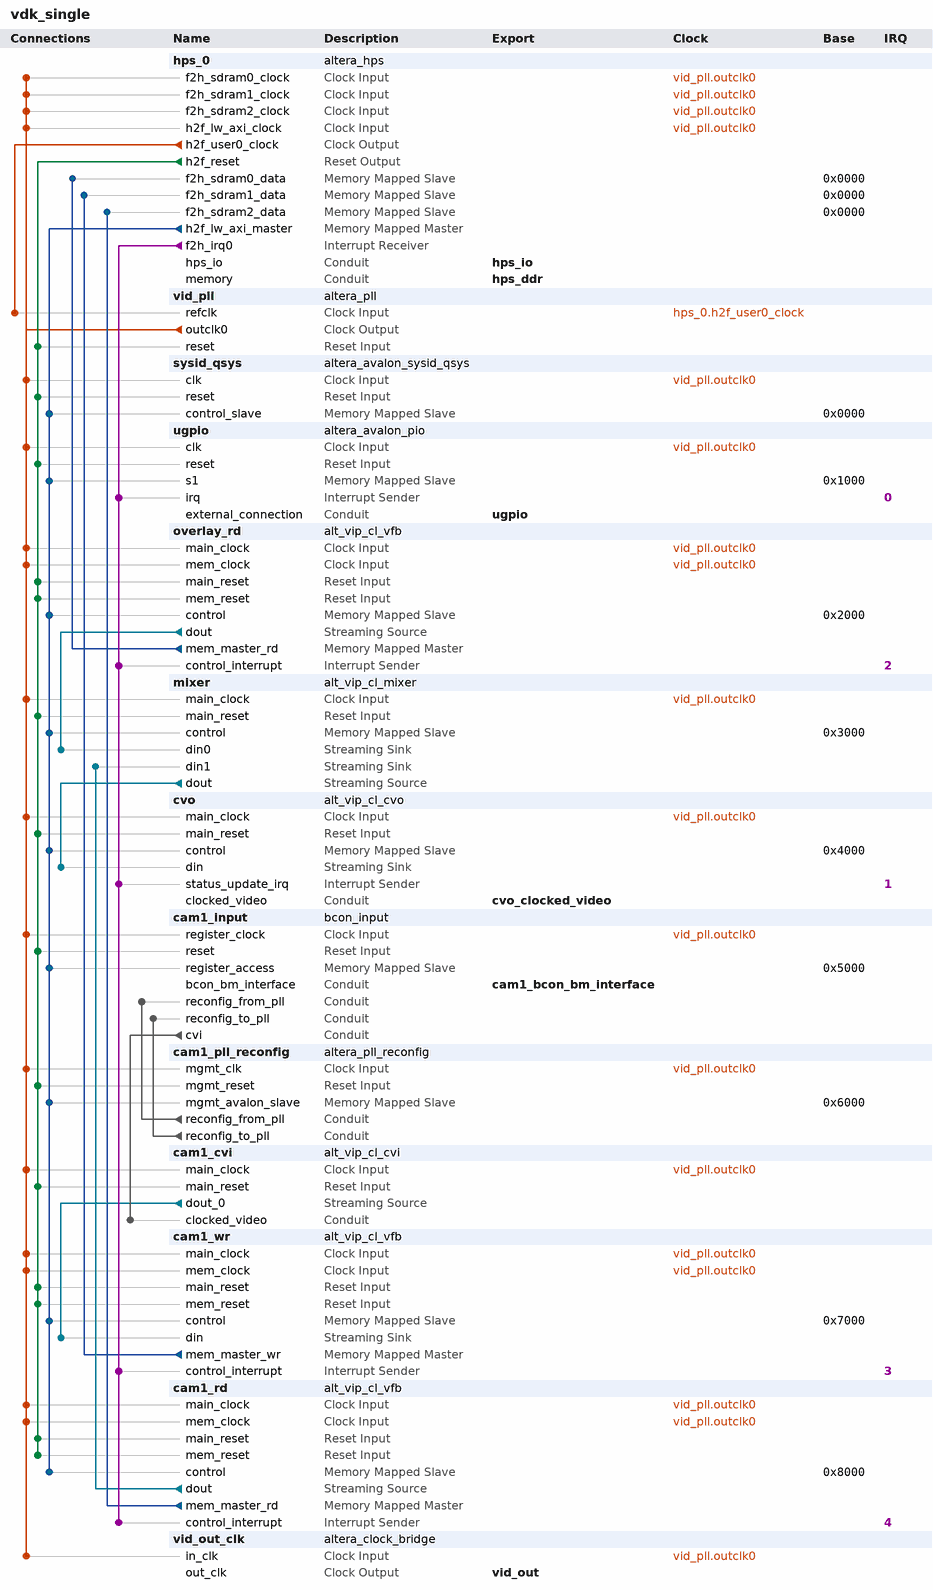
[diagram p0: system contents]
# Platform Designer (Qsys) system vdk_single, Cyclone V 5CSXFC6C6U23C7
# Parameters at their usual value, and those the tool derives, are not listed.
package require -exact qsys 17.0
create_system vdk_single
set_project_property DEVICE_FAMILY {Cyclone V}
set_project_property DEVICE 5CSXFC6C6U23C7

add_instance hps_0 altera_hps 17.0
set_instance_parameter_value hps_0 EMAC1_Mode RGMII
set_instance_parameter_value hps_0 EMAC1_PinMuxing {HPS I/O Set 0}
set_instance_parameter_value hps_0 F2SCLK_COLDRST_Enable false
set_instance_parameter_value hps_0 F2SCLK_DBGRST_Enable false
set_instance_parameter_value hps_0 F2SCLK_WARMRST_Enable false
set_instance_parameter_value hps_0 F2SDRAM_Type {Avalon-MM Read-Only,Avalon-MM Write-Only,Avalon-MM Read-Only}
set_instance_parameter_value hps_0 F2SDRAM_Width 64,64,64
set_instance_parameter_value hps_0 F2SINTERRUPT_Enable true
set_instance_parameter_value hps_0 F2S_Width 0
set_instance_parameter_value hps_0 FPGA_PERIPHERAL_OUTPUT_CLOCK_FREQ_EMAC0_GTX_CLK 100
set_instance_parameter_value hps_0 FPGA_PERIPHERAL_OUTPUT_CLOCK_FREQ_EMAC0_MD_CLK 100.0
set_instance_parameter_value hps_0 FPGA_PERIPHERAL_OUTPUT_CLOCK_FREQ_EMAC1_GTX_CLK 100
set_instance_parameter_value hps_0 FPGA_PERIPHERAL_OUTPUT_CLOCK_FREQ_EMAC1_MD_CLK 100.0
set_instance_parameter_value hps_0 HPS_PROTOCOL DDR3
set_instance_parameter_value hps_0 I2C0_Mode I2C
set_instance_parameter_value hps_0 I2C0_PinMuxing {HPS I/O Set 1}
set_instance_parameter_value hps_0 I2C1_Mode I2C
set_instance_parameter_value hps_0 I2C1_PinMuxing {HPS I/O Set 0}
set_instance_parameter_value hps_0 LWH2F_Enable true
set_instance_parameter_value hps_0 MEM_ASR Automatic
set_instance_parameter_value hps_0 MEM_BANKADDR_WIDTH 3
set_instance_parameter_value hps_0 MEM_CLK_FREQ 400.0
set_instance_parameter_value hps_0 MEM_COL_ADDR_WIDTH 10
set_instance_parameter_value hps_0 MEM_DQ_WIDTH 40
set_instance_parameter_value hps_0 MEM_DRV_STR RZQ/7
set_instance_parameter_value hps_0 MEM_ROW_ADDR_WIDTH 15
set_instance_parameter_value hps_0 MEM_RTT_NOM RZQ/4
set_instance_parameter_value hps_0 MEM_RTT_WR {Dynamic ODT off}
set_instance_parameter_value hps_0 MEM_TCL 7
set_instance_parameter_value hps_0 MEM_TFAW_NS 30.0
set_instance_parameter_value hps_0 MEM_TRAS_NS 35.0
set_instance_parameter_value hps_0 MEM_TRCD_NS 13.75
set_instance_parameter_value hps_0 MEM_TRFC_NS 260.0
set_instance_parameter_value hps_0 MEM_TRP_NS 13.75
set_instance_parameter_value hps_0 MEM_TRRD_NS 10.0
set_instance_parameter_value hps_0 MEM_TRTP_NS 10.0
set_instance_parameter_value hps_0 MEM_VENDOR JEDEC
set_instance_parameter_value hps_0 MEM_VOLTAGE {1.35V DDR3L}
set_instance_parameter_value hps_0 MEM_WTCL 6
set_instance_parameter_value hps_0 QSPI_Mode {2 SS}
set_instance_parameter_value hps_0 QSPI_PinMuxing {HPS I/O Set 1}
set_instance_parameter_value hps_0 REF_CLK_FREQ 25.0
set_instance_parameter_value hps_0 S2FCLK_USER0CLK_Enable true
set_instance_parameter_value hps_0 S2FCLK_USER2CLK 5
set_instance_parameter_value hps_0 S2F_Width 0
set_instance_parameter_value hps_0 SDIO_Mode {4-bit Data}
set_instance_parameter_value hps_0 SDIO_PinMuxing {HPS I/O Set 0}
set_instance_parameter_value hps_0 SPIM1_Mode N/A
set_instance_parameter_value hps_0 SPIM1_PinMuxing Unused
set_instance_parameter_value hps_0 STM_Enable false
set_instance_parameter_value hps_0 TIMING_BOARD_AC_SKEW 0.0
set_instance_parameter_value hps_0 TIMING_BOARD_AC_TO_CK_SKEW 0.0
set_instance_parameter_value hps_0 TIMING_BOARD_DQ_TO_DQS_SKEW 0.0
set_instance_parameter_value hps_0 TIMING_BOARD_MAX_CK_DELAY 0.6
set_instance_parameter_value hps_0 TIMING_BOARD_MAX_DQS_DELAY 0.2
set_instance_parameter_value hps_0 TIMING_BOARD_SKEW_BETWEEN_DQS 0.01
set_instance_parameter_value hps_0 TIMING_BOARD_SKEW_CKDQS_DIMM_MAX 0.215
set_instance_parameter_value hps_0 TIMING_BOARD_SKEW_CKDQS_DIMM_MIN 0.092
set_instance_parameter_value hps_0 TIMING_BOARD_SKEW_WITHIN_DQS 0.0
set_instance_parameter_value hps_0 TIMING_TDH 45
set_instance_parameter_value hps_0 TIMING_TDQSCK 225
set_instance_parameter_value hps_0 TIMING_TDQSQ 100
set_instance_parameter_value hps_0 TIMING_TDQSS 0.27
set_instance_parameter_value hps_0 TIMING_TDS 10
set_instance_parameter_value hps_0 TIMING_TDSH 0.18
set_instance_parameter_value hps_0 TIMING_TDSS 0.18
set_instance_parameter_value hps_0 TIMING_TIH 120
set_instance_parameter_value hps_0 TIMING_TIS 170
set_instance_parameter_value hps_0 TIMING_TQSH 0.4
set_instance_parameter_value hps_0 UART0_Mode {No Flow Control}
set_instance_parameter_value hps_0 UART0_PinMuxing {HPS I/O Set 2}
set_instance_parameter_value hps_0 USB1_Mode SDR
set_instance_parameter_value hps_0 USB1_PinMuxing {HPS I/O Set 0}
set_instance_parameter_value hps_0 desired_cfg_clk_mhz 100.0
set_instance_parameter_value hps_0 desired_qspi_clk_mhz 400.0

add_instance vid_pll altera_pll 17.0
set_instance_parameter_value vid_pll gui_device_speed_grade 2
set_instance_parameter_value vid_pll gui_number_of_clocks 1
set_instance_parameter_value vid_pll gui_operation_mode direct
set_instance_parameter_value vid_pll gui_output_clock_frequency0 74.25
set_instance_parameter_value vid_pll gui_pll_mode {Integer-N PLL}
set_instance_parameter_value vid_pll gui_reference_clock_frequency 100.0
set_instance_parameter_value vid_pll gui_use_locked false

add_instance sysid_qsys altera_avalon_sysid_qsys 17.0
set_instance_parameter_value sysid_qsys id 1

add_instance ugpio altera_avalon_pio 17.0
set_instance_parameter_value ugpio bitClearingEdgeCapReg true
set_instance_parameter_value ugpio bitModifyingOutReg true
set_instance_parameter_value ugpio captureEdge true
set_instance_parameter_value ugpio direction Bidir
set_instance_parameter_value ugpio generateIRQ true
set_instance_parameter_value ugpio irqType EDGE
set_instance_parameter_value ugpio width 7

add_instance overlay_rd alt_vip_cl_vfb 17.0
set_instance_parameter_value overlay_rd CLOCKS_ARE_SEPARATE 1
set_instance_parameter_value overlay_rd DROP_FRAMES 1
set_instance_parameter_value overlay_rd DROP_INVALID_FIELDS 1
set_instance_parameter_value overlay_rd DROP_REPEAT_USER 0
set_instance_parameter_value overlay_rd IS_FRAME_READER 1
set_instance_parameter_value overlay_rd MAX_HEIGHT 720
set_instance_parameter_value overlay_rd MAX_WIDTH 1280
set_instance_parameter_value overlay_rd MEM_BASE_ADDR 536870912
set_instance_parameter_value overlay_rd MEM_BUFFER_OFFSET 16777216
set_instance_parameter_value overlay_rd MEM_PORT_WIDTH 64
set_instance_parameter_value overlay_rd READER_RUNTIME_CONTROL 1
set_instance_parameter_value overlay_rd READ_FIFO_DEPTH 64
set_instance_parameter_value overlay_rd USER_PACKETS_MAX_STORAGE 0
set_instance_parameter_value overlay_rd USE_BUFFER_OFFSET 0
set_instance_parameter_value overlay_rd WRITE_BURST_TARGET 32
set_instance_parameter_value overlay_rd WRITE_FIFO_DEPTH 64

add_instance mixer alt_vip_cl_mixer 17.0
set_instance_parameter_value mixer ALPHA_ENABLE 1
set_instance_parameter_value mixer ALPHA_STREAMS_ENABLE 0
set_instance_parameter_value mixer BITS_PER_SYMBOL 8
set_instance_parameter_value mixer COLOR_PLANES_ARE_IN_PARALLEL 1
set_instance_parameter_value mixer COLOR_SPACE RGB
set_instance_parameter_value mixer FAMILY {Cyclone V}
set_instance_parameter_value mixer IS_422 1
set_instance_parameter_value mixer LAYER_POSITION_ENABLE 1
set_instance_parameter_value mixer MAX_HEIGHT 720
set_instance_parameter_value mixer MAX_WIDTH 1280
set_instance_parameter_value mixer NO_OF_INPUTS 2
set_instance_parameter_value mixer NUMBER_OF_COLOR_PLANES 2
set_instance_parameter_value mixer PATTERN uniform
set_instance_parameter_value mixer PIPELINE_READY 0
set_instance_parameter_value mixer PIXELS_IN_PARALLEL 1
set_instance_parameter_value mixer UNIFORM_VALUE_BCR 0
set_instance_parameter_value mixer UNIFORM_VALUE_GCB 0
set_instance_parameter_value mixer UNIFORM_VALUE_RY 255
set_instance_parameter_value mixer USER_PACKET_FIFO_DEPTH 0
set_instance_parameter_value mixer USER_PACKET_SUPPORT DISCARD

add_instance cvo alt_vip_cl_cvo 17.0
set_instance_parameter_value cvo ACCEPT_COLOURS_IN_SEQ 0
set_instance_parameter_value cvo ANC_LINE 0
set_instance_parameter_value cvo AP_LINE 0
set_instance_parameter_value cvo BPS 8
set_instance_parameter_value cvo CLOCKS_ARE_SAME 1
set_instance_parameter_value cvo COLOUR_PLANES_ARE_IN_PARALLEL 1
set_instance_parameter_value cvo CONTEXT_WIDTH 8
set_instance_parameter_value cvo DST_WIDTH 8
set_instance_parameter_value cvo FIELD0_ANC_LINE 0
set_instance_parameter_value cvo FIELD0_V_BACK_PORCH 0
set_instance_parameter_value cvo FIELD0_V_BLANK 0
set_instance_parameter_value cvo FIELD0_V_FRONT_PORCH 0
set_instance_parameter_value cvo FIELD0_V_RISING_EDGE 0
set_instance_parameter_value cvo FIELD0_V_SYNC_LENGTH 0
set_instance_parameter_value cvo FIFO_DEPTH 1280
set_instance_parameter_value cvo F_FALLING_EDGE 0
set_instance_parameter_value cvo F_RISING_EDGE 0
set_instance_parameter_value cvo GENERATE_SYNC 0
set_instance_parameter_value cvo H_ACTIVE_PIXELS 1280
set_instance_parameter_value cvo H_BACK_PORCH 148
set_instance_parameter_value cvo H_BLANK 0
set_instance_parameter_value cvo H_FRONT_PORCH 88
set_instance_parameter_value cvo H_SYNC_LENGTH 44
set_instance_parameter_value cvo INTERLACED 0
set_instance_parameter_value cvo LOW_LATENCY 0
set_instance_parameter_value cvo NO_OF_CHANNELS 1
set_instance_parameter_value cvo NO_OF_MODES 1
set_instance_parameter_value cvo NUMBER_OF_COLOUR_PLANES 3
set_instance_parameter_value cvo PIXELS_IN_PARALLEL 1
set_instance_parameter_value cvo SRC_WIDTH 8
set_instance_parameter_value cvo STD_WIDTH 1
set_instance_parameter_value cvo TASK_WIDTH 8
set_instance_parameter_value cvo THRESHOLD 1279
set_instance_parameter_value cvo USE_CONTROL 1
set_instance_parameter_value cvo USE_EMBEDDED_SYNCS 0
set_instance_parameter_value cvo V_ACTIVE_LINES 720
set_instance_parameter_value cvo V_BACK_PORCH 36
set_instance_parameter_value cvo V_BLANK 0
set_instance_parameter_value cvo V_FRONT_PORCH 4
set_instance_parameter_value cvo V_SYNC_LENGTH 5

add_instance cam1_input bcon_input 1.1
set_instance_parameter_value cam1_input g_lane_invert 31
set_instance_parameter_value cam1_input g_vid_data_length 24

add_instance cam1_pll_reconfig altera_pll_reconfig 17.0

add_instance cam1_cvi alt_vip_cl_cvi 17.0
set_instance_parameter_value cam1_cvi ACCEPT_COLOURS_IN_SEQ 0
set_instance_parameter_value cam1_cvi ANC_DEPTH 1
set_instance_parameter_value cam1_cvi BPS 8
set_instance_parameter_value cam1_cvi CLOCKS_ARE_SAME 0
set_instance_parameter_value cam1_cvi COLOUR_PLANES_ARE_IN_PARALLEL 1
set_instance_parameter_value cam1_cvi EXTRACT_TOTAL_RESOLUTION 1
set_instance_parameter_value cam1_cvi FIFO_DEPTH 4096
set_instance_parameter_value cam1_cvi GENERATE_ANC 0
set_instance_parameter_value cam1_cvi GENERATE_VID_F 0
set_instance_parameter_value cam1_cvi H_ACTIVE_PIXELS_F0 2592
set_instance_parameter_value cam1_cvi INTERLACED 0
set_instance_parameter_value cam1_cvi MATCH_CTRLDATA_PKT_CLIP_BASIC 0
set_instance_parameter_value cam1_cvi MATCH_CTRLDATA_PKT_PAD_ADV 0
set_instance_parameter_value cam1_cvi NO_OF_CHANNELS 1
set_instance_parameter_value cam1_cvi NUMBER_OF_COLOUR_PLANES 3
set_instance_parameter_value cam1_cvi OVERFLOW_HANDLING 0
set_instance_parameter_value cam1_cvi PIXELS_IN_PARALLEL 1
set_instance_parameter_value cam1_cvi STD_WIDTH 1
set_instance_parameter_value cam1_cvi SYNC_TO 0
set_instance_parameter_value cam1_cvi USE_CONTROL 0
set_instance_parameter_value cam1_cvi USE_EMBEDDED_SYNCS 0
set_instance_parameter_value cam1_cvi USE_HDMI_DEPRICATION 0
set_instance_parameter_value cam1_cvi USE_STD 0
set_instance_parameter_value cam1_cvi V_ACTIVE_LINES_F0 1944
set_instance_parameter_value cam1_cvi V_ACTIVE_LINES_F1 480

add_instance cam1_wr alt_vip_cl_vfb 17.0
set_instance_parameter_value cam1_wr CLOCKS_ARE_SEPARATE 1
set_instance_parameter_value cam1_wr DROP_FRAMES 1
set_instance_parameter_value cam1_wr DROP_INVALID_FIELDS 1
set_instance_parameter_value cam1_wr DROP_REPEAT_USER 0
set_instance_parameter_value cam1_wr IS_FRAME_READER 0
set_instance_parameter_value cam1_wr IS_FRAME_WRITER 1
set_instance_parameter_value cam1_wr MAX_HEIGHT 1944
set_instance_parameter_value cam1_wr MAX_WIDTH 2592
set_instance_parameter_value cam1_wr MEM_BASE_ADDR 587202560
set_instance_parameter_value cam1_wr MEM_BUFFER_OFFSET 16777216
set_instance_parameter_value cam1_wr MEM_PORT_WIDTH 64
set_instance_parameter_value cam1_wr READER_RUNTIME_CONTROL 0
set_instance_parameter_value cam1_wr READ_FIFO_DEPTH 64
set_instance_parameter_value cam1_wr USER_PACKETS_MAX_STORAGE 0
set_instance_parameter_value cam1_wr USE_BUFFER_OFFSET 0
set_instance_parameter_value cam1_wr WRITER_RUNTIME_CONTROL 1
set_instance_parameter_value cam1_wr WRITE_BURST_TARGET 32
set_instance_parameter_value cam1_wr WRITE_FIFO_DEPTH 64

add_instance cam1_rd alt_vip_cl_vfb 17.0
set_instance_parameter_value cam1_rd CLOCKS_ARE_SEPARATE 1
set_instance_parameter_value cam1_rd DROP_FRAMES 1
set_instance_parameter_value cam1_rd DROP_INVALID_FIELDS 1
set_instance_parameter_value cam1_rd DROP_REPEAT_USER 0
set_instance_parameter_value cam1_rd IS_FRAME_READER 1
set_instance_parameter_value cam1_rd MAX_HEIGHT 1944
set_instance_parameter_value cam1_rd MAX_WIDTH 2592
set_instance_parameter_value cam1_rd MEM_BASE_ADDR 587202560
set_instance_parameter_value cam1_rd MEM_BUFFER_OFFSET 16777216
set_instance_parameter_value cam1_rd MEM_PORT_WIDTH 64
set_instance_parameter_value cam1_rd READER_RUNTIME_CONTROL 1
set_instance_parameter_value cam1_rd READ_FIFO_DEPTH 64
set_instance_parameter_value cam1_rd USER_PACKETS_MAX_STORAGE 0
set_instance_parameter_value cam1_rd USE_BUFFER_OFFSET 0
set_instance_parameter_value cam1_rd WRITE_BURST_TARGET 32
set_instance_parameter_value cam1_rd WRITE_FIFO_DEPTH 64

add_instance vid_out_clk altera_clock_bridge 17.0
set_instance_parameter_value vid_out_clk DERIVED_CLOCK_RATE 74242424
set_instance_parameter_value vid_out_clk EXPLICIT_CLOCK_RATE 0

# connections
add_connection hps_0.h2f_user0_clock vid_pll.refclk clock
add_connection vid_pll.outclk0 cam1_cvi.main_clock clock
add_connection vid_pll.outclk0 cam1_input.register_clock clock
add_connection vid_pll.outclk0 cam1_pll_reconfig.mgmt_clk clock
add_connection vid_pll.outclk0 cam1_rd.main_clock clock
add_connection vid_pll.outclk0 cam1_rd.mem_clock clock
add_connection vid_pll.outclk0 cam1_wr.main_clock clock
add_connection vid_pll.outclk0 cam1_wr.mem_clock clock
add_connection vid_pll.outclk0 cvo.main_clock clock
add_connection vid_pll.outclk0 hps_0.f2h_sdram0_clock clock
add_connection vid_pll.outclk0 hps_0.f2h_sdram1_clock clock
add_connection vid_pll.outclk0 hps_0.f2h_sdram2_clock clock
add_connection vid_pll.outclk0 hps_0.h2f_lw_axi_clock clock
add_connection vid_pll.outclk0 mixer.main_clock clock
add_connection vid_pll.outclk0 overlay_rd.main_clock clock
add_connection vid_pll.outclk0 overlay_rd.mem_clock clock
add_connection vid_pll.outclk0 sysid_qsys.clk clock
add_connection vid_pll.outclk0 ugpio.clk clock
add_connection vid_pll.outclk0 vid_out_clk.in_clk clock
add_connection hps_0.h2f_reset cam1_cvi.main_reset reset
add_connection hps_0.h2f_reset cam1_input.reset reset
add_connection hps_0.h2f_reset cam1_pll_reconfig.mgmt_reset reset
add_connection hps_0.h2f_reset cam1_rd.main_reset reset
add_connection hps_0.h2f_reset cam1_rd.mem_reset reset
add_connection hps_0.h2f_reset cam1_wr.main_reset reset
add_connection hps_0.h2f_reset cam1_wr.mem_reset reset
add_connection hps_0.h2f_reset cvo.main_reset reset
add_connection hps_0.h2f_reset mixer.main_reset reset
add_connection hps_0.h2f_reset overlay_rd.main_reset reset
add_connection hps_0.h2f_reset overlay_rd.mem_reset reset
add_connection hps_0.h2f_reset sysid_qsys.reset reset
add_connection hps_0.h2f_reset ugpio.reset reset
add_connection hps_0.h2f_reset vid_pll.reset reset
add_connection cam1_rd.mem_master_rd hps_0.f2h_sdram2_data avalon
set_connection_parameter_value cam1_rd.mem_master_rd/hps_0.f2h_sdram2_data baseAddress 0x0000
add_connection cam1_wr.mem_master_wr hps_0.f2h_sdram1_data avalon
set_connection_parameter_value cam1_wr.mem_master_wr/hps_0.f2h_sdram1_data baseAddress 0x0000
add_connection hps_0.h2f_lw_axi_master cam1_input.register_access avalon
set_connection_parameter_value hps_0.h2f_lw_axi_master/cam1_input.register_access baseAddress 0x5000
add_connection hps_0.h2f_lw_axi_master cam1_pll_reconfig.mgmt_avalon_slave avalon
set_connection_parameter_value hps_0.h2f_lw_axi_master/cam1_pll_reconfig.mgmt_avalon_slave baseAddress 0x6000
add_connection hps_0.h2f_lw_axi_master cam1_rd.control avalon
set_connection_parameter_value hps_0.h2f_lw_axi_master/cam1_rd.control baseAddress 0x8000
add_connection hps_0.h2f_lw_axi_master cam1_wr.control avalon
set_connection_parameter_value hps_0.h2f_lw_axi_master/cam1_wr.control baseAddress 0x7000
add_connection hps_0.h2f_lw_axi_master cvo.control avalon
set_connection_parameter_value hps_0.h2f_lw_axi_master/cvo.control baseAddress 0x4000
add_connection hps_0.h2f_lw_axi_master mixer.control avalon
set_connection_parameter_value hps_0.h2f_lw_axi_master/mixer.control baseAddress 0x3000
add_connection hps_0.h2f_lw_axi_master overlay_rd.control avalon
set_connection_parameter_value hps_0.h2f_lw_axi_master/overlay_rd.control baseAddress 0x2000
add_connection hps_0.h2f_lw_axi_master sysid_qsys.control_slave avalon
set_connection_parameter_value hps_0.h2f_lw_axi_master/sysid_qsys.control_slave baseAddress 0x0000
add_connection hps_0.h2f_lw_axi_master ugpio.s1 avalon
set_connection_parameter_value hps_0.h2f_lw_axi_master/ugpio.s1 baseAddress 0x1000
add_connection overlay_rd.mem_master_rd hps_0.f2h_sdram0_data avalon
set_connection_parameter_value overlay_rd.mem_master_rd/hps_0.f2h_sdram0_data baseAddress 0x0000
add_connection cam1_cvi.dout_0 cam1_wr.din avalon_streaming
add_connection cam1_rd.dout mixer.din1 avalon_streaming
add_connection mixer.dout cvo.din avalon_streaming
add_connection overlay_rd.dout mixer.din0 avalon_streaming
add_connection cam1_input.cvi cam1_cvi.clocked_video conduit
add_connection cam1_pll_reconfig.reconfig_from_pll cam1_input.reconfig_from_pll conduit
add_connection cam1_pll_reconfig.reconfig_to_pll cam1_input.reconfig_to_pll conduit
add_connection hps_0.f2h_irq0 cam1_rd.control_interrupt interrupt
set_connection_parameter_value hps_0.f2h_irq0/cam1_rd.control_interrupt irqNumber 4
add_connection hps_0.f2h_irq0 cam1_wr.control_interrupt interrupt
set_connection_parameter_value hps_0.f2h_irq0/cam1_wr.control_interrupt irqNumber 3
add_connection hps_0.f2h_irq0 cvo.status_update_irq interrupt
set_connection_parameter_value hps_0.f2h_irq0/cvo.status_update_irq irqNumber 1
add_connection hps_0.f2h_irq0 overlay_rd.control_interrupt interrupt
set_connection_parameter_value hps_0.f2h_irq0/overlay_rd.control_interrupt irqNumber 2
add_connection hps_0.f2h_irq0 ugpio.irq interrupt
set_connection_parameter_value hps_0.f2h_irq0/ugpio.irq irqNumber 0

# exported interfaces
add_interface cam1_bcon_bm_interface conduit end
set_interface_property cam1_bcon_bm_interface EXPORT_OF cam1_input.bcon_bm_interface
add_interface cvo_clocked_video conduit end
set_interface_property cvo_clocked_video EXPORT_OF cvo.clocked_video
add_interface hps_ddr conduit end
set_interface_property hps_ddr EXPORT_OF hps_0.memory
add_interface hps_io conduit end
set_interface_property hps_io EXPORT_OF hps_0.hps_io
add_interface ugpio conduit end
set_interface_property ugpio EXPORT_OF ugpio.external_connection
add_interface vid_out clock source
set_interface_property vid_out EXPORT_OF vid_out_clk.out_clk

set_interconnect_requirement {$system} qsys_mm.clockCrossingAdapter HANDSHAKE
set_interconnect_requirement {$system} qsys_mm.enableEccProtection FALSE
set_interconnect_requirement {$system} qsys_mm.insertDefaultSlave FALSE
set_interconnect_requirement {$system} qsys_mm.maxAdditionalLatency 4

save_system vdk_single.qsys
